# EAGLE design Versorgung-MAX1724 (EAGLE 4.15)
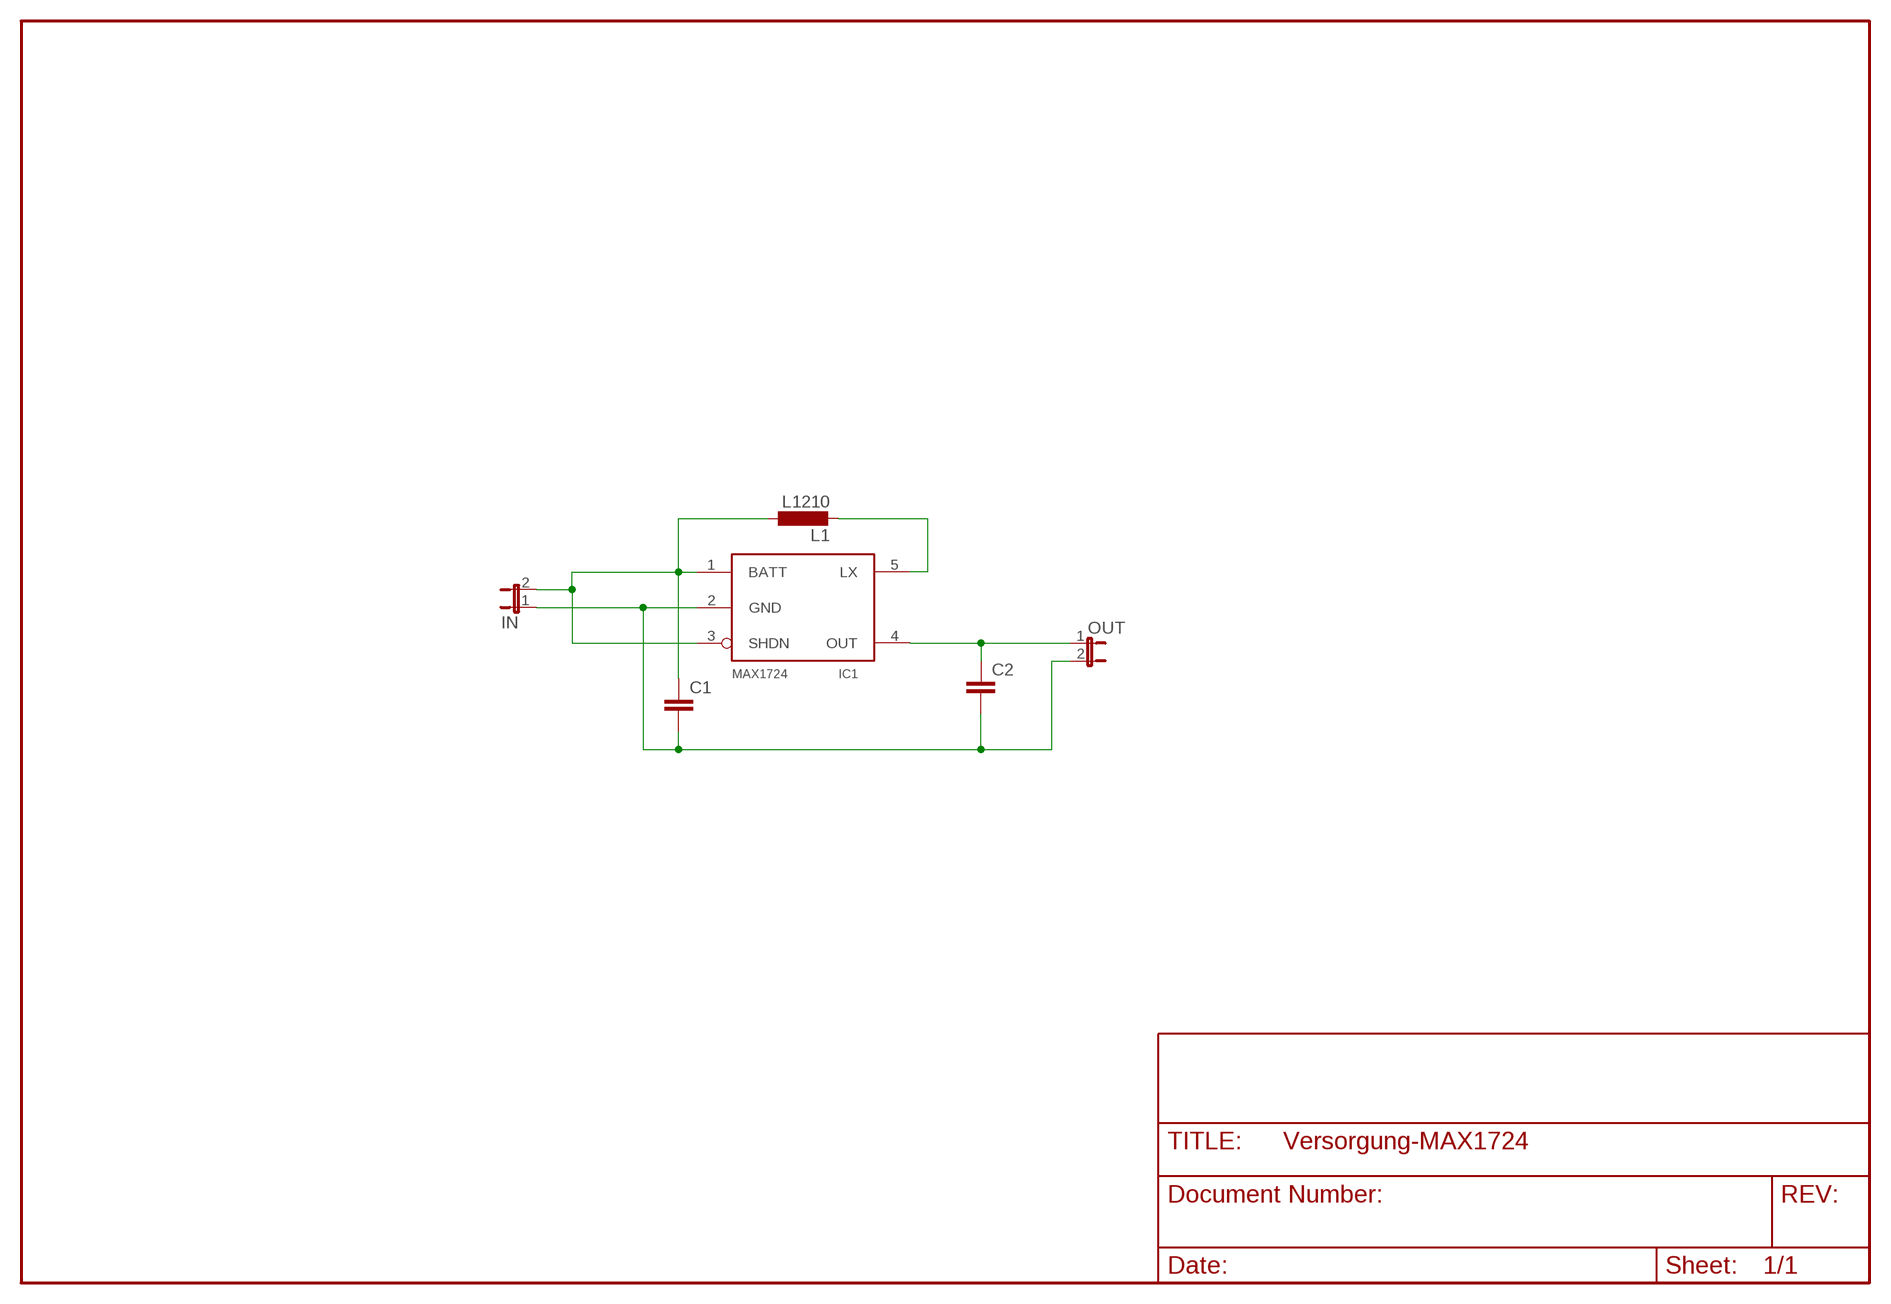
[diagram p0: schematic, sheet 1]

## Parts
C1  C-EUC0805  [C0805]
C2  C-EUC0805  [C0805]
IC1  MAX1724  [SOT23-5L]
IN  JP1E  [JP1]
L1  L1210  [C1210]
OUT  JP1E  [JP1]

## Nets
N$1: C1.1 IC1.1(BATT) IC1.3(SHDN) IN.2 L1.1
N$2: C1.2 C2.2 IC1.2(GND) IN.1 OUT.2
N$3: IC1.5(LX) L1.2
N$4: C2.1 IC1.4(OUT) OUT.1

## Library data of the parts
C1 C2 = turbod3:C-EU: CAPACITOR, European symbol
IC1 = turbod3:MAX1724
IN OUT = jumper:JP1E: JUMPER
L1 = turbod3:L

## Board
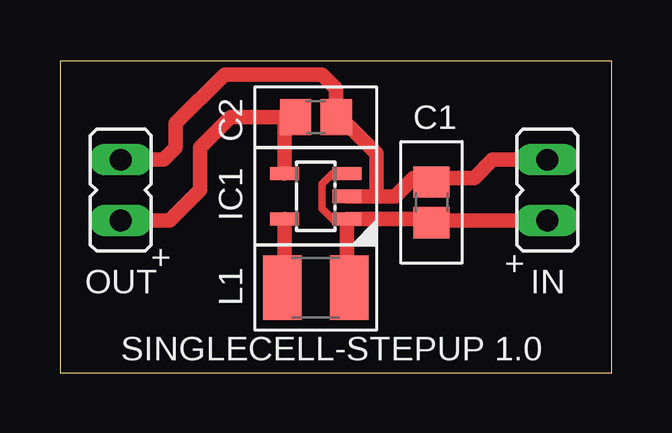
[diagram p1: board, top side]

Size 23 x 13 mm. Coordinates in mm from the lower left corner, seen from the top.
Outline: 0,0 23,0 23,13 0,13 0,0
Copper layers (1*16): Top 0.035mm / dielectric 1.5mm / Bottom 0.035mm
Design rules "PCB-POOL": minimum track width 6mil, minimum drill 12mil, track to track 6mil, track to pad 6mil, pad to pad 6mil, via to via 6mil, smd to smd 6mil, copper to edge 20mil, drill to drill 8mil, minimum pad ring 8mil, minimum via ring 6mil, stop-mask expansion 3mil, vias tented up to drill 0mil, thermal gap 8mil

### Footprints (pad centres in the part's own frame; a part is rotated, then mirrored left to right if it is on the bottom)
C0805 = smd 1.3 x 1.5: 1 -0.85,0; 2 0.85,0
SOT23-5L = smd 0.55 x 1.2: 1 -0.95,-1.3; 2 0,-1.3; 3 0.95,-1.3; 4 0.95,1.3; 5 -0.95,1.3
JP1 = drill 0.914 long: 1 0,-1.27; 2 0,1.27
C1210 = smd 1.6 x 2.7: 1 -1.4,0; 2 1.4,0

### Placement (x,y rotation side)
C1  15.49,7.11 90 top
C2  10.67,10.67 0 top
IC1  10.67,7.37 90 top
IN  20.32,7.62 180 top
L1  10.67,3.56 180 top
OUT  2.54,7.62 0 top

### Tracks (layer width: path | path; a pad name or v marks a point on that pad's centre or on a via)
N$1
  Top 0.305: IC1.3 11.36,8.32 10.92,7.87 10.92,6.86 11.43,6.35 12.19,6.35 12.13,6.42 IC1.1
  Top 0.406: 15.49,6.35 15.75,6.1 | 15.24,6.35 15.33,6.26 C1.1 15.49,6.35 | 15.43,6.42 15.49,6.35 | 11.97,4.09 11.94,4.06 11.94,3.81 12.07,3.68 L1.1
  Top 0.61: 15.43,6.42 IC1.1 11.97,4.09 | C1.1 15.49,6.1 15.75,6.35 IN.2
N$2
  Top 0.406: 15.49,8.13 C1.2 | IC1.2 12.95,7.37 13.21,7.62 | C2.2 11.43,10.92
  Top 0.61: IC1.2 13.97,7.37 14.73,8.13 15.49,8.13 | 13.21,7.62 13.21,9.14 11.43,10.92 | C2.2 11.52,11.85 10.92,12.45 6.86,12.45 4.83,10.41 4.83,9.4 4.32,8.89 OUT.2 | IN.1 18.03,8.89 17.27,8.13 15.75,8.13 15.49,7.87 C1.2
N$3
  Top 0.406: L1.2 9.4,3.56 9.37,3.59
  Top 0.61: 9.37,3.59 IC1.5
N$4
  Top 0.406: C2.1 9.65,10.92 9.37,10.64 | OUT.1 2.29,6.35 2.29,6.1
  Top 0.61: IC1.4 9.37,10.64 | C2.1 7.11,10.67 5.84,9.4 5.84,7.62 4.57,6.35 2.29,6.35

### Text on the board
tNames: + | + | SINGLECELL-STEPUP 1.0